# EAGLE schematic Waveshaper (EAGLE 7.3.0)
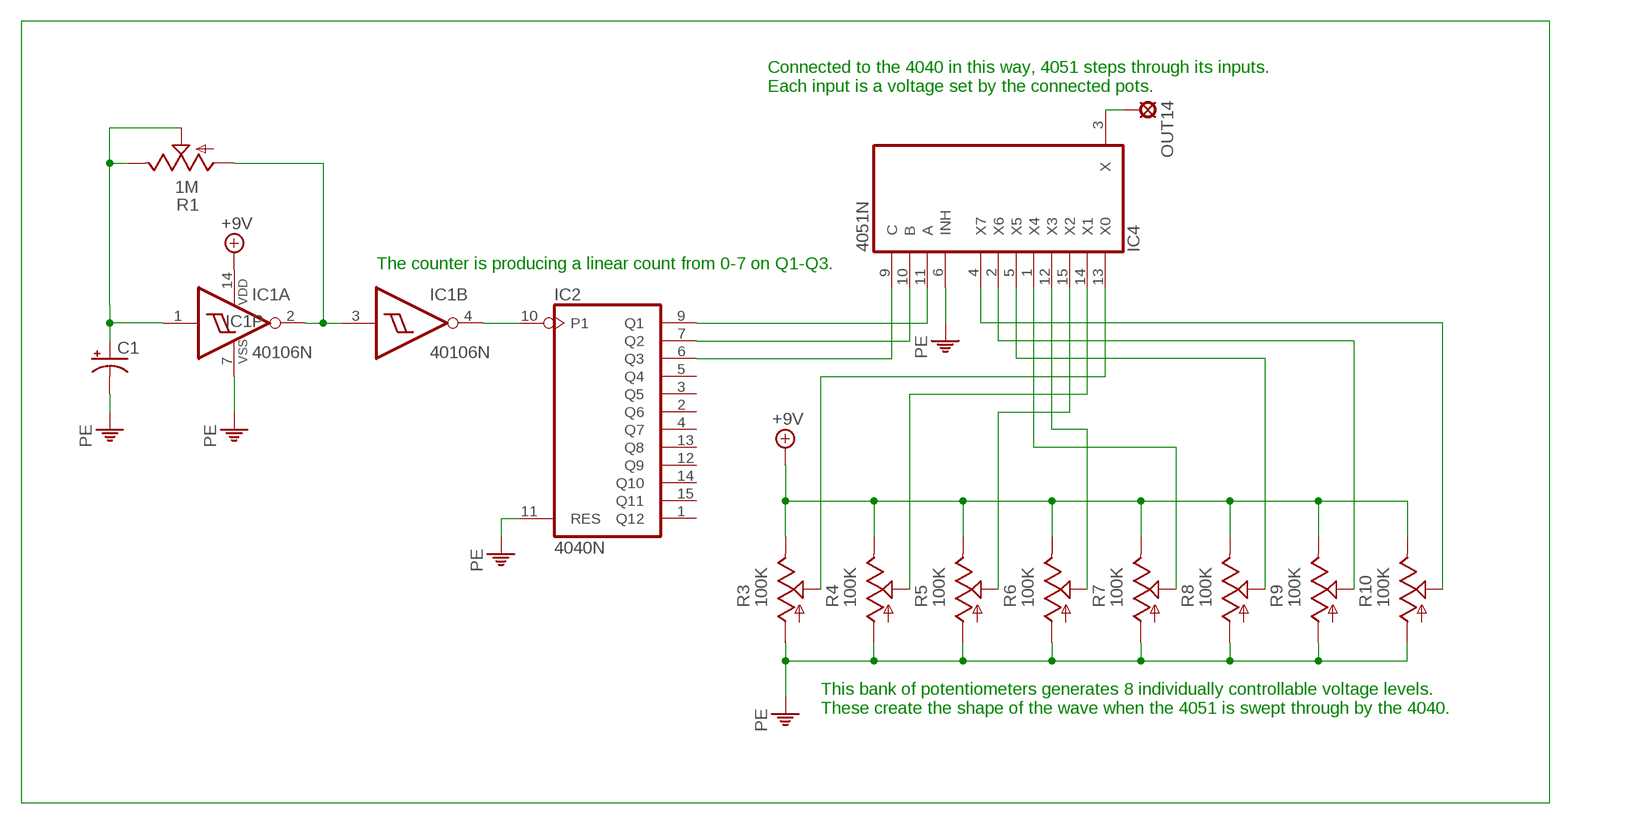
[diagram p0: schematic, sheet 1]

## Parts
C1  CPOL-USE2,5-6E  [E2,5-6E]
IC1  40106N  [DIL14]
IC2  4040N  [DIL16]
IC4  4051N  [DIL16]
OUT14  MCS10B  [MCS10B]
R1  1M  US-EVUF2A  [EVUF]
R3  100K  US-EVUF2A  [EVUF]
R4  100K  US-EVUF2A  [EVUF]
R5  100K  US-EVUF2A  [EVUF]
R6  100K  US-EVUF2A  [EVUF]
R7  100K  US-EVUF2A  [EVUF]
R8  100K  US-EVUF2A  [EVUF]
R9  100K  US-EVUF2A  [EVUF]
R10  100K  US-EVUF2A  [EVUF]

## Nets
+9V: IC1.14(P:VDD) R3.3(E) R4.3(E) R5.3(E) R6.3(E) R7.3(E) R8.3(E) R9.3(E) R10.3(E)
N$1: IC2.9(Q1) IC4.11(A)
N$2: IC1.4(B:O) IC2.10(P1)
N$3: IC1.2(A:O) IC1.3(B:I) R1.1(A)
N$4: R1.2(S) R1.3(E)
N$5: IC2.7(Q2) IC4.10(B)
N$6: IC2.6(Q3) IC4.9(C)
N$7: IC4.13(X0) R3.2(S)
N$8: IC4.14(X1) R4.2(S)
N$9: IC4.15(X2) R5.2(S)
N$10: IC4.12(X3) R6.2(S)
N$11: IC4.1(X4) R7.2(S)
N$12: IC4.5(X5) R8.2(S)
N$13: IC4.2(X6) R9.2(S)
N$14: IC4.4(X7) R10.2(S)
N$28: C1.+ IC1.1(A:I)
N$38: IC4.3(X) OUT14.MP
PE: C1.- IC1.7(P:VSS) IC2.11(RES) IC4.6(INH) R3.1(A) R4.1(A) R5.1(A) R6.1(A) R7.1(A) R8.1(A) R9.1(A) R10.1(A)
Unconnected: IC1.5(C:I) IC1.6(C:O) IC1.8(D:O) IC1.9(D:I) IC1.10(E:O) IC1.11(E:I) IC1.12(F:O) IC1.13(F:I) IC2.1(Q12) IC2.2(Q6) IC2.3(Q5) IC2.4(Q7) IC2.5(Q4) IC2.12(Q9) IC2.13(Q8) IC2.14(Q10) IC2.15(Q11)

## Notes on the sheet
- Connected to the 4040 in this way, 4051 steps through its inputs.
  Each input is a voltage set by the connected pots.
- The counter is producing a linear count from 0-7 on Q1-Q3.
- This bank of potentiometers generates 8 individually controllable voltage levels.
  These create the shape of the wave when the 4051 is swept through by the 4040.

## Power pins joined to a net without a drawn wire
GND: IC4.8(GND)
VCC: IC4.16(VCC)
VDD: IC2.16(VDD)
VEE: IC4.7(VEE)
VSS: IC2.8(VSS)

## Library data of the parts
C1 = rcl:CPOL-US: POLARIZED CAPACITOR, American symbol
IC1 = 40xx:40106: Hex SCHMITT TRIGGER
IC2 = 40xx:4040: 12-stage binary/ripple COUNTER
IC4 = 40xx:4051: 8-channel ANALOG MULTIPLEXER
OUT14 = solpad:MCS10B: SOLDER PAD MC S1, distributor Buerklin, 15F505
R1 R3-R10 = pot:US-EVU: 9 mm Square Rotary Potentiometers Source: Panasonic